# Altium schematic sheet Sheet1-edgy.SchDoc
size A4
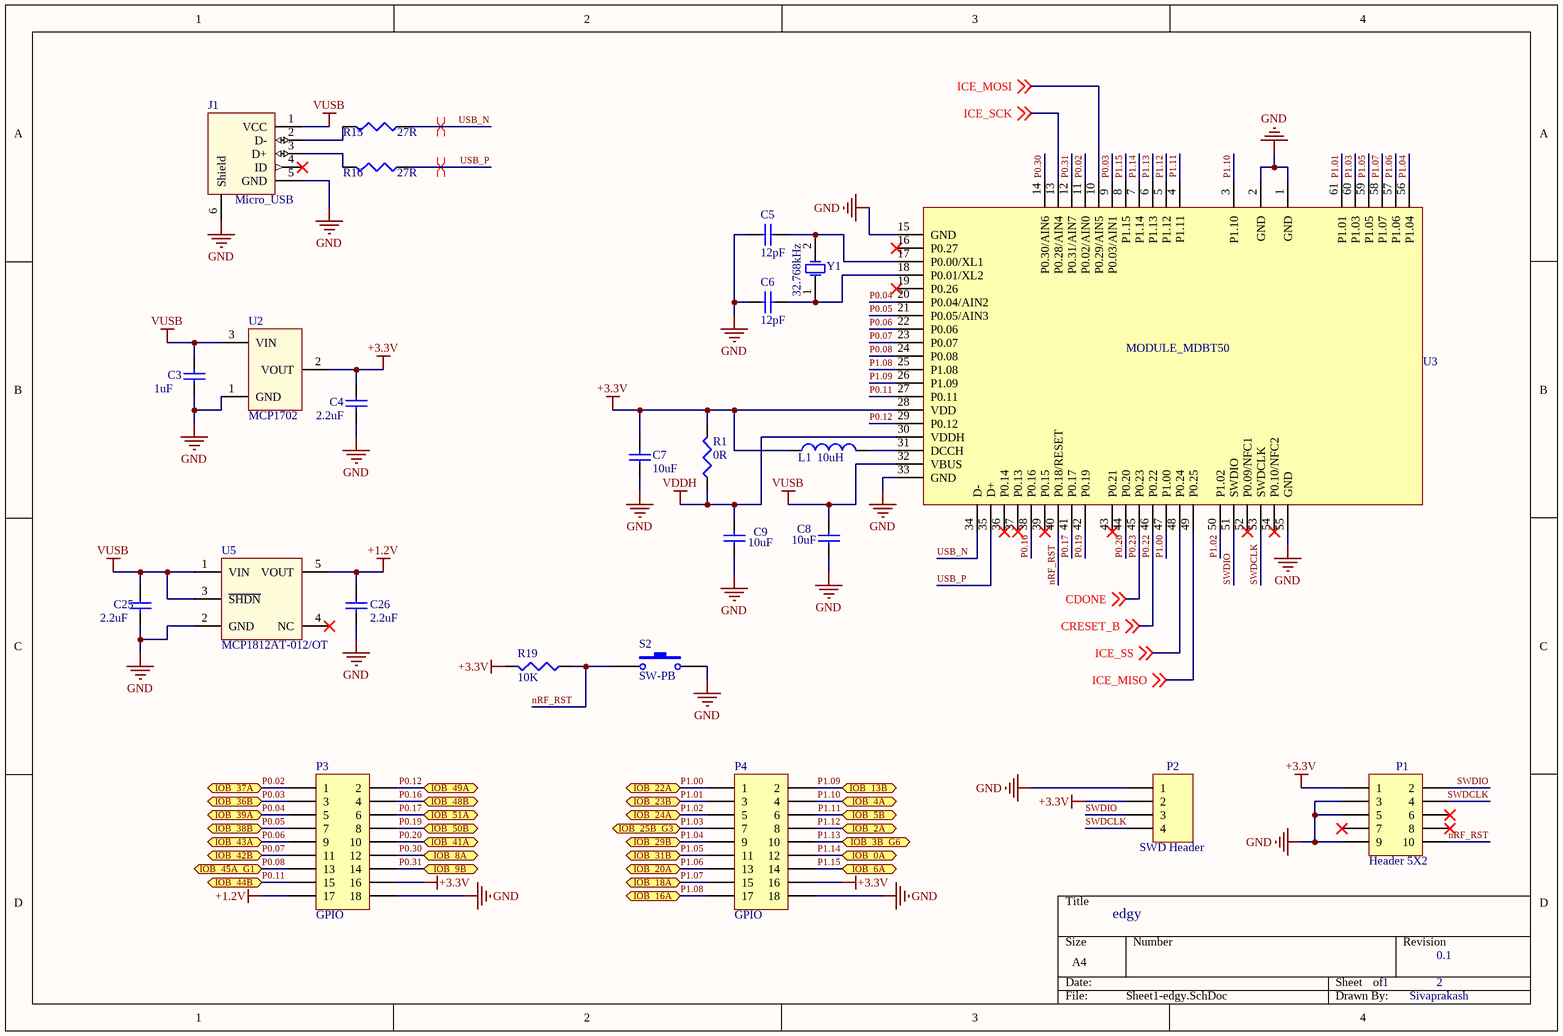
[diagram p0: Sheet1-edgy.SchDoc]

## Parts
C3  1uF  [1608[0603]]
C4  2.2uF  [1608[0603]]
C5  12pF  [1608[0603]]
C6  12pF  [1608[0603]]
C7  10uF  [1608[0603]]
C8  10uF  [1608[0603]]
C9  10uF  [1608[0603]]
C25  2.2uF  [1608[0603]]
C26  2.2uF  [1608[0603]]
J1  Micro_USB  [Micro_USB]
L1  10uH  [INDC1608L]
P1  Header 5X2  [2x5_1.27mm_pitch_header]
P2  SWD Header  [4pin_2.54mm_header]
P3  GPIO  [2x9_2.54mm pitch_header]
P4  GPIO  [2x9_2.54mm pitch_header]
R1  0R  [J1-0603]
R15  27R  [J1-0603]
R16  27R  [J1-0603]
R19  10K  [J1-0603]
S2  SW-PB  [Tact_Switch]
U2  MCP1702  [SOT-23]
U3  MODULE_MDBT50  [PCB_MDBT50_10.5X15.5]
U5  MCP1812AT-012/OT  [SOT23-5BN]
Y1  32.768kHz  [32.768kHz_crystal]

## Ports
IOB_0A (bidir), IOB_2A (bidir), IOB_3B_G6 (bidir), IOB_4A (bidir), IOB_5B (bidir), IOB_6A (bidir), IOB_8A (bidir), IOB_9B (bidir), IOB_13B (bidir), IOB_16A (bidir), IOB_18A (bidir), IOB_20A (bidir), IOB_22A (bidir), IOB_23B (bidir), IOB_24A (bidir), IOB_25B_G3 (bidir), IOB_29B (bidir), IOB_31B (bidir), IOB_36B (bidir), IOB_37A (bidir), IOB_38B (bidir), IOB_39A (bidir), IOB_41A (bidir), IOB_42B (bidir), IOB_43A (bidir), IOB_44B (bidir), IOB_45A_G1 (bidir), IOB_48B (bidir), IOB_49A (bidir), IOB_50B (bidir), IOB_51A (bidir)

## Nets
+1.2V: C26.2 P3.17 U5.5(VOUT)
+3.3V: C4.2 C7.2 L1.1 P1.1 P2.2 P3.16 P4.16 R1.2 R19.2 U2.2(VOUT) U3.28(VDD)
GND: C3.1 C4.1 C5.1 C6.1 C7.1 C8.1 C9.1 C25.1 C26.1 J1.5(GND) J1.6(Shield) P1.3 P1.5 P1.9 P2.1 P3.18 P4.18 S2.2 U2.1(GND) U3.1(GND) U3.2(GND) U3.15(GND) U3.33(GND) U3.55(GND) U5.2(GND)
VDDH: C9.2 R1.1 U3.30(VDDH)
VUSB: C3.2 C8.2 C25.2 J1.1(VCC) U2.3(VIN) U3.32(VBUS) U5.1(VIN) U5.3(~{SHDN})
ICE_MISO: U3.49(P0.25) ; off-sheet ICE_MISO
ICE_MOSI: U3.10(P0.29/AIN5) ; off-sheet ICE_MOSI
ICE_SCK: U3.13(P0.28/AIN4) ; off-sheet ICE_SCK
ICE_SS: U3.48(P0.24) ; off-sheet ICE_SS
nRF_RST: P1.10 R19.1 S2.1 U3.40(P0.18/RESET)
P0.02: P3.1 U3.11(P0.02/AIN0) ; port IOB_37A
P0.03: P3.3 U3.9(P0.03/AIN1) ; port IOB_36B
P0.04: P3.5 U3.20(P0.04/AIN2) ; port IOB_39A
P0.05: P3.7 U3.21(P0.05/AIN3) ; port IOB_38B
P0.06: P3.9 U3.22(P0.06) ; port IOB_43A
P0.07: P3.11 U3.23(P0.07) ; port IOB_42B
P0.08: P3.13 U3.24(P0.08) ; port IOB_45A_G1
P0.11: P3.15 U3.27(P0.11) ; port IOB_44B
P0.12: P3.2 U3.29(P0.12) ; port IOB_49A
P0.16: P3.4 U3.38(P0.16) ; port IOB_48B
P0.17: P3.6 U3.41(P0.17) ; port IOB_51A
P0.19: P3.8 U3.42(P0.19) ; port IOB_50B
P0.20: P3.10 U3.44(P0.20) ; port IOB_41A
P0.22: U3.46(P0.22) ; off-sheet CRESET_B  [also labelled CRESET_B]
P0.23: U3.45(P0.23) ; off-sheet CDONE  [also labelled CDONE]
P0.30: P3.12 U3.14(P0.30/AIN6) ; port IOB_8A
P0.31: P3.14 U3.12(P0.31/AIN7) ; port IOB_9B
P1.00: P4.1 U3.47(P1.00) ; port IOB_22A
P1.01: P4.3 U3.61(P1.01) ; port IOB_23B
P1.02: P4.5 U3.50(P1.02) ; port IOB_24A
P1.03: P4.7 U3.60(P1.03) ; port IOB_25B_G3
P1.04: P4.9 U3.56(P1.04) ; port IOB_29B
P1.05: P4.11 U3.59(P1.05) ; port IOB_31B
P1.06: P4.13 U3.57(P1.06) ; port IOB_20A
P1.07: P4.15 U3.58(P1.07) ; port IOB_18A
P1.08: P4.17 U3.25(P1.08) ; port IOB_16A
P1.09: P4.2 U3.26(P1.09) ; port IOB_13B
P1.10: P4.4 U3.3(P1.10) ; port IOB_4A
P1.11: P4.6 U3.4(P1.11) ; port IOB_5B
P1.12: P4.8 U3.5(P1.12) ; port IOB_2A
P1.13: P4.10 U3.6(P1.13) ; port IOB_3B_G6
P1.14: P4.12 U3.7(P1.14) ; port IOB_0A
P1.15: P4.14 U3.8(P1.15) ; port IOB_6A
SWDCLK: P1.4 P2.4 U3.53(SWDCLK)
SWDIO: P1.2 P2.3 U3.51(SWDIO)
USB_N: R15.1 U3.34(D-)
USB_P: R16.1 U3.35(D+)
NetC5_2: C5.2 U3.17(P0.00/XL1) Y1.2(OSC2)
NetC6_2: C6.2 U3.18(P0.01/XL2) Y1.1(OSC1)
NetJ1_2: J1.2(D-) R15.2
NetJ1_3: J1.3(D+) R16.2
NetL1_2: L1.2 U3.31(DCCH)

Not connected (* = marked no-connect by the designer): J1 4(ID)*; P1 6* 7* 8*; U3 16(P0.27)* 19(P0.26)* 36(P0.14)* 37(P0.13)* 39(P0.15)* 43(P0.21)* 52(P0.09/NFC1)* 54(P0.10/NFC2)*; U5 4(NC)*

## Layout directives
differential pair: USB_N, USB_P

## Notes on the sheet
- edgy
- 1
- 0.1
- 2
- Sivaprakash

## Library data of the parts
C3-C9 C25 C26 = Cap Semi: Capacitor (Semiconductor SIM Model); Published: 8-Jun-2000; LatestRevisionDate: 29-May-2009; LatestRevisionNote: IPC-7351 Footprint Added.; PackageReference: C1206; Publisher: Altium Limited; PackageDescription: Chip Capacitor
J1 = Micro_USB: Micro USB 2.0
L1 = Inductor: Code_IEC: 1005; Published: 8-Jun-2000; LatestRevisionDate: 29-May-2009; LatestRevisionNote: IPC-7351 Footprint Added.; PackageReference: 0402-A; Publisher: Altium Limited; PackageDescription: Chip Inductor; Code_JEITA: 0402
P1 = Header 5X2: Header, 5-Pin, Dual row; LatestRevisionDate: 17-Jul-2002; LatestRevisionNote: Re-released for DXP Platform.; Publisher: Altium Limited
P2 = Header 4: Header, 4-Pin; LatestRevisionDate: 17-Jul-2002; LatestRevisionNote: Re-released for DXP Platform.; Publisher: Altium Limited
P3 P4 = Header 9X2: Header, 9-Pin, Dual row; LatestRevisionDate: 17-Jul-2002; LatestRevisionNote: Re-released for DXP Platform.; Publisher: Altium Limited
R1 R15 R16 R19 = Res3: Resistor; Published: 8-Jun-2000; LatestRevisionDate: 29-May-2009; LatestRevisionNote: IPC-7351 Footprint Added.; PackageReference: J1-0603; Publisher: Altium Limited; PackageDescription: Chip Resistor
S2 = SW-PB: Switch; Published: 24-Mar-1999; LatestRevisionDate: 17-Jul-2002; LatestRevisionNote: Re-released for DXP Platform.; PackageReference: SPST-2; Publisher: Altium Limited; PackageDescription: Switch; 2 Leads
U2 = MCP1702: 3.3 V Low Quasient Current LDO
U3 = MODULE_MDBT50: MDBT50
U5 = MCP1812AT-012/OT: Manufacturer: Microchip; Supplier 1: Mouser; Manufacturer Part Number: MCP1812AT-012/OT; Stock 1: 2995; Pricing 1: 1=0.4, 10=0.395, 50=0.329, 100=0.298, 1000=0.298, 10000=0.298 (USD); Supplier Part Number 1: 579-MCP1812AT-012/OT
Y1 = XTAL: Crystal Oscillator; Published: 8-Jun-2000; LatestRevisionDate: 17-Jul-2002; LatestRevisionNote: Re-released for DXP Platform.; PackageReference: R38; Publisher: Altium Limited; PackageDescription: Crystal, Thru-Hole; 2 Leads; Body 3.1 x 8.2 mm (Dia.xH)